# Altium project BMS.PrjPcb (part 2 of 2)

## Sheet NPN_CONNECTOR.SchDoc: BMS - AFE
size A4; DrawnBy: Jarod Krane; SheetNumber: 7; SheetTotal: 8
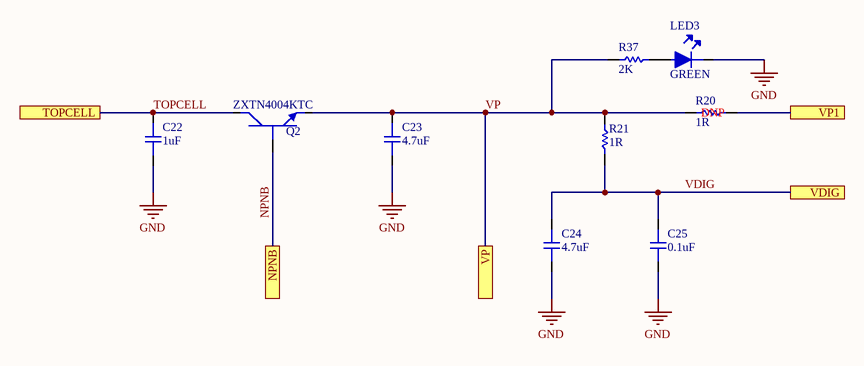
[diagram p6: NPN_CONNECTOR.SchDoc]

### Parts
C22  1uF  [0805 CAP]
C23  4.7uF  [1206 CAP]
C24  4.7uF  [0805 CAP]
C25  0.1uF  [0603 CAP - duplicate]
LED3  GREEN  [LED2]
Q2  ZXTN4004KTC  [NPN TRANSISTOR]
R20  1R  [0603 RES]
R21  1R  [0603 RES]
R37  2K  [0603 RES]

### Ports
NPNB, TOPCELL, VDIG, VP, VP1

### Nets
GND: C22.1 C23.1 C24.1 C25.1 LED3.2
NPNB: Q2.1 ; port NPNB
TOPCELL: C22.2 Q2.2 ; port TOPCELL
VDIG: C24.2 C25.2 R21.1 ; port VDIG
VIO: R20.2 ; port VP1
VP: C23.2 Q2.3 R20.1 R21.2 R37.1 ; port VP
NetLED3_1: LED3.1 R37.2

### Notes on the sheet
- (near R20) DNP

### Library data of the parts
C22 = C2012X7S2A105K125AE: CAP CER 1UF 100V X7S 0805; Manufacturer: TDK; Tolerance: 10%; Supplier 1: Digi-Key; Manufacturer Part Number: C2012X7S2A105K125AE; Stock 1: 20000; Pricing 1: 1=0.5, 10=0.356, 100=0.2347, 500=0.1739, 1000=0.1478 (USD); Mount: Surface Mount; Case/Package: 0805; Case Code (Metric): 2012; Case Code (Imperial): 0805; Min Operating Temperature: -55°C; Max Operating Temperature: 125°C; Capacitance: 1uF; Voltage Rating: 100V; Packaging: Tape and Reel; Termination: SMD/SMT; Package Quantity: 1; Voltage Rating (DC): 100V; Dielectric: X7S; Composition: Ceramic; Features: Soft Termination; Length: 2mm; Height: 1.25mm; Width: 0.05inch; Thickness: 0.049inch; Depth: 1.25mm; Lead Free: Lead Free; ComponentLink1URL: https://product.tdk.com/info/en/catalog/spec/mlccspec_commercial_soft_en.pdf; ComponentLink1Description: https://product.tdk.com/info/en/catalog/spec/mlccspec_commercial_soft_en.pdf; ComponentLink2URL: http://www.mouser.com/ds/2/400/lcc_commercial_soft_en-520032.pdf; ComponentLink2Description: http://www.mouser.com/ds/2/400/lcc_commercial_soft_en-520032.pdf; Supplier Part Number 1: 445-8887-1-ND
C23 = GRM31CR71H475KA12L: CAP CER 4.7UF 50V X7R 1206; Manufacturer: Murata; Material: Ceramic; Tolerance: 10%; Supplier 1: Digi-Key; Manufacturer Part Number: GRM31CR71H475KA12L; Stock 1: 0; Pricing 1: 1=0.98, 10=0.723, 100=0.4961, 500=0.3928, 1000=0.3307 (USD); Mount: Surface Mount; Case/Package: 1206; Case Code (Metric): 3216; Case Code (Imperial): 1206; Min Operating Temperature: -55°C; Max Operating Temperature: 125°C; Capacitance: 4.7uF; Voltage Rating: 50V; Packaging: Tape and Reel; Voltage Rating (DC): 50V; Package Quantity: 2000; Dielectric: X7R; Termination: SMD/SMT; Voltage: 50V; Length: 3.2mm; Height: 1.6mm; Width: 0.063inch; Thickness: 0.071inch; Depth: 1.6mm; Radiation Hardening: No; REACH SVHC: No SVHC; Lead Free: Lead Free; Supplier Part Number 1: 490-6521-1-ND
C24 = CL21B475KOFNFNE: CAP CER 4.7UF 16V X7R 0805; Manufacturer: Samsung; Tolerance: 10%; Supplier 1: Digi-Key; Manufacturer Part Number: CL21B475KOFNFNE; Stock 1: 20000; Pricing 1: 1=0.3, 10=0.208, 100=0.1181, 500=0.0833, 1000=0.0729 (USD); Mount: Surface Mount; Case/Package: 0805; Case Code (Metric): 2012; Case Code (Imperial): 0805; Min Operating Temperature: -55°C; Max Operating Temperature: 125°C; Package Quantity: 1; Packaging: Tape and Reel; Capacitance: 4.7uF; Voltage Rating: 16V; Dielectric: X7R; Length: 0.079inch; Height: 1.25mm; Width: 0.049inch; Thickness: 0.053inch; Depth: 1.25mm; Radiation Hardening: No; Supplier Part Number 1: 1276-2970-1-ND
C25 = 06035C104KAZ2A: CAP CER 0.1UF 50V X7R 0603; Manufacturer: Kyocera AVX; Capacitance: 100nF; Tolerance: 10%; Temperature Coefficient: 30ppm/°C; Supplier 1: Digi-Key; Manufacturer Part Number: 06035C104KAZ2A; Stock 1: 40000; Pricing 1: 1=0.23, 10=0.161, 100=0.0756, 500=0.053, 1000=0.0439 (USD); Mount: PCB,Surface Mount; Case/Package: 0603; Number of Pins: 2; Case Code (Metric): 1608; Case Code (Imperial): 0603; Contact Plating: Matte,Tin; Min Operating Temperature: -55°C; Max Operating Temperature: 125°C; Package Quantity: 1; Voltage Rating: 50V; Packaging: Tape and Reel; Voltage Rating (DC): 50V; Dielectric: X7R; Termination: SMD/SMT; Voltage: 50V; Features: Soft Termination; Length: 1.6mm; Height: 0.94mm; Width: 0.032inch; Thickness: 0.035inch; Depth: 0.81mm; Radiation Hardening: No; REACH SVHC: No SVHC; Lead Free: Lead Free; Supplier Part Number 1: 478-3540-1-ND
LED3 = 150060VS75000: LED GREEN CLEAR 0603 SMD; Manufacturer: Wurth Electronics; Luminous Intensity: 40mcd; Viewing Angle: 140°; Forward Voltage: 2V; Wavelength: 570nm; Lens Style: Clear,Rectangular; Forward Current: 30mA; Test Current: 20mA; Supplier 1: Digi-Key; Manufacturer Part Number: 150060VS75000; Stock 1: 219425; Pricing 1: 1=0.14, 50=0.129, 100=0.11, 500=0.095 (USD); Mount: Surface Mount; Case/Package: 0603; Number of Pins: 2; Colour: Green; Case Code (Metric): 1608; Case Code (Imperial): 0603; Min Operating Temperature: -40°C; Max Operating Temperature: 85°C; Package Quantity: 1; Packaging: Tape and Reel; Dominant Wavelength: 570nm; Length: 1.6mm; Height: 0.7mm; Width: 0.8mm; REACH SVHC: Unknown; ComponentLink1URL: http://www.farnell.com/datasheets/1911347.pdf; ComponentLink1Description: http://www.farnell.com/datasheets/1911347.pdf; ComponentLink2URL: https://katalog.we-online.de/led/datasheet/150060VS75000.pdf; ComponentLink2Description: https://katalog.we-online.de/led/datasheet/150060VS75000.pdf; ComponentLink3URL: https://www.distrelec.biz/Web/Downloads/_t/ds/150060VS75000_eng_tds.pdf?mime=application%2Fpdf; ComponentLink3Description: https://www.distrelec.biz/Web/Downloads/_t/ds/150060VS75000_eng_tds.pdf?mime=application%2Fpdf; ComponentLink4URL: http://www.produktinfo.conrad.com/datenblaetter/750000-774999/759431-da-01-en-CHIPLED_0603_W_KL_H_GRUEN_150060VS7500.pdf; ComponentLink4Description: http://www.produktinfo.conrad.com/datenblaetter/750000-774999/759431-da-01-en-CHIPLED_0603_W_KL_H_GRUEN_150060VS7500.pdf; Supplier Part Number 1: 732-4980-1-ND
Q2 = ZXTN4004KTC: TRANS NPN 150V 1A TO252; Manufacturer: Diodes; Max Power Dissipation: 3.8W; Number of Elements: 1; hFE Min: 100; Emitter Base Voltage (VEBO): 7V; Element Configuration: Single; Supplier 1: Digi-Key; Manufacturer Part Number: ZXTN4004KTC; Stock 1: 27399; Pricing 1: 1=0.49, 10=0.42, 100=0.3134, 500=0.2463, 1000=0.1903 (USD); Mount: Surface Mount; Case/Package: TO-252; Number of Pins: 3; Weight: 0.063493oz; Min Operating Temperature: -55°C; Max Operating Temperature: 150°C; Packaging: Tape and Reel; Package Quantity: 2500; Polarity: NPN; Collector Emitter Voltage (VCEO): 150V; Collector Base Voltage (VCBO): 150V; Continuous Collector Current: 1A; Max Collector Current: 1A; Collector Emitter Breakdown Voltage: 150V; Max Breakdown Voltage: 150V; Power Dissipation: 3.8W; Length: 6.7mm; Height: 6.2mm; Width: 2.39mm; Radiation Hardening: No; Lead Free: Lead Free; REACH SVHC: No SVHC; Supplier Part Number 1: ZXTN4004KTCDICT-ND
R20 R21 = CRL0603-FW-1R00ELF: RES SMD 1 OHM 1% 1/10W 0603; Manufacturer: Bourns; Power Rating: 100mW; Temperature Coefficient: 200ppm/°C; Supplier 1: Digi-Key; Manufacturer Part Number: CRL0603-FW-1R00ELF; Stock 1: 1350; Pricing 1: 1=0.13, 10=0.116, 100=0.0448, 1000=0.0197, 2500=0.017 (USD); Mount: Surface Mount; Case/Package: 0603; Case Code (Metric): 1608; Case Code (Imperial): 0603; Contact Plating: Tin; Min Operating Temperature: -55°C; Max Operating Temperature: 125°C; Resistance: 1R; Packaging: Tape and Reel; Tolerance: 1%; Package Quantity: 5000; Composition: Thick Film; Number of Terminations: 2; Termination: SMD/SMT; Military Standard: Not; Max Power Dissipation: 100mW; Length: 1.6mm; Height: 0.45mm; Width: 0.8mm; Depth: 0.8mm; Radiation Hardening: No; REACH SVHC: No SVHC; Supplier Part Number 1: CRL0603-FW-1R00ELFCT-ND
R37 = CRCW06032K00FKEA: RES SMD 2K OHM 1% 1/10W 0603; Manufacturer: Vishay; Power Rating: 100mW; Resistance: 2kR; Voltage Rating: 75V; Temperature Coefficient: 100ppm/°C; Supplier 1: Digi-Key; Manufacturer Part Number: CRCW06032K00FKEA; Stock 1: 388348; Pricing 1: 1=0.1, 10=0.042, 100=0.017, 1000=0.0076, 2500=0.0066 (USD); Mount: Surface Mount; Case/Package: 0603; Number of Pins: 2; Weight: 7.1E-05oz; Case Code (Imperial): 0603; Case Code (Metric): 1608; Contact Plating: Lead,Tin; Min Operating Temperature: -55°C; Max Operating Temperature: 155°C; Tolerance: 1%; Packaging: Tape and Reel; Composition: Thick Film; Package Quantity: 10; Military Standard: Not; Termination: Solder; Voltage Rating (DC): 75V; Number of Terminations: 2; Max Power Dissipation: 100mW; Features: Automotive AEC-Q200; Length: 1.55mm; Height: 0.45mm; Width: 0.85mm; Depth: 0.85mm; Radiation Hardening: No; REACH SVHC: Unknown; Lead Free: Lead Free; Supplier Part Number 1: 541-2.00KHCT-ND

## Sheet Serial.SchDoc: Serial connection
size A4; DrawnBy: Jarod Krane; SheetNumber: 8; SheetTotal: 8
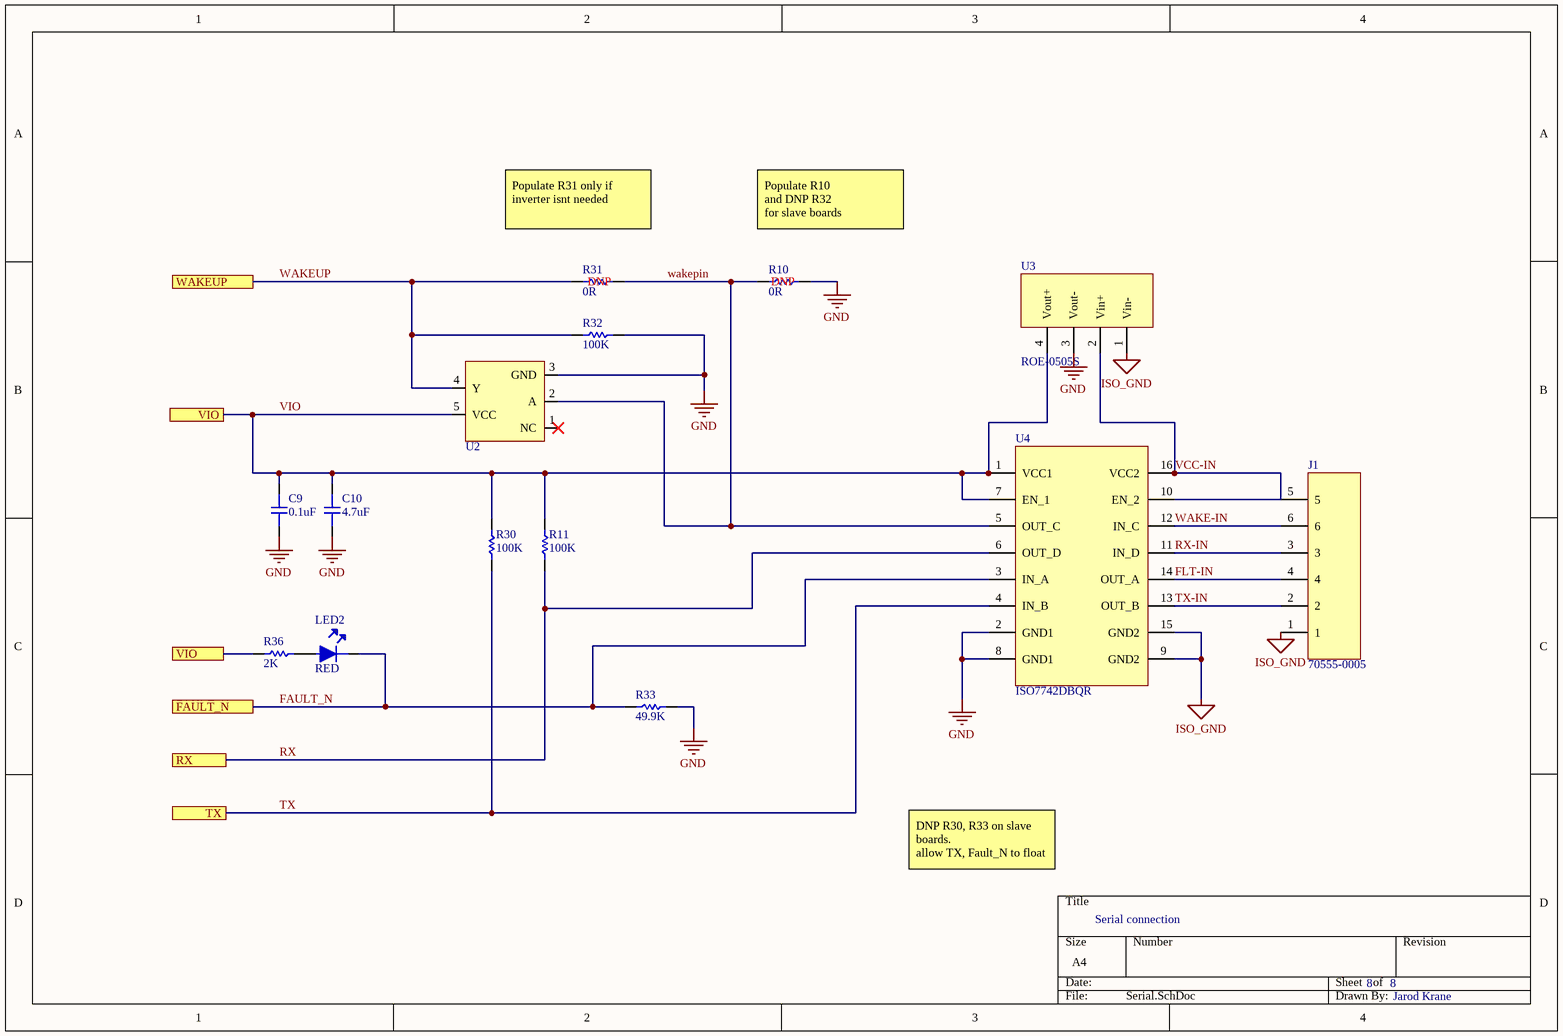
[diagram p7: Serial.SchDoc]

### Parts
C9  0.1uF  [0603 CAP - duplicate]
C10  4.7uF  [0805 CAP]
J1  70555-0005  [SERIAL HDR]
LED2  RED  [LED2]
R10  0R  [1206 RES]
R11  100K  [0603 RES]
R30  100K  [0603 RES]
R31  0R  [1206 RES]
R32  100K  [0603 RES]
R33  49.9K  [0603 RES]
R36  2K  [0603 RES]
U2  NC7SZ04M5X  [Inverter]  (value not drawn)
U3  ROE-0505S  [5V-ISO]
U4  ISO7742DBQR  [Serial-ISO]

### Ports
FAULT_N, RX, TX, VIO, WAKEUP

### Nets
GND: C9.1 C10.1 R10.2 R32.2 R33.2 U2.3(GND) U3.3(Vout-) U4.2(GND1) U4.8(GND1)
ISO_GND: J1.1 U3.1(Vin-) U4.9(GND2) U4.15(GND2)
FAULT_N: LED2.2 R33.1 U4.3(IN_A) ; port FAULT_N
FLT-IN: J1.4 U4.14(OUT_A)
RX: R11.1 U4.6(OUT_D) ; port RX
RX-IN: J1.3 U4.11(IN_D)
TX: R30.1 U4.4(IN_B) ; port TX
TX-IN: J1.2 U4.13(OUT_B)
VCC-IN: J1.5 U3.2(Vin+) U4.10(EN_2) U4.16(VCC2)
VIO: C9.2 C10.2 R11.2 R30.2 R36.2 U2.5(VCC) U3.4(Vout+) U4.1(VCC1) U4.7(EN_1) ; port VIO
WAKE-IN: J1.6 U4.12(IN_C)
wakepin: R10.1 R31.2 U2.2(A) U4.5(OUT_C)
WAKEUP: R31.1 R32.1 U2.4(Y) ; port WAKEUP
NetLED2_1: LED2.1 R36.1

Not connected (* = marked no-connect by the designer): U2 1(NC)*

### Notes on the sheet
- (near R31) Populate R31 only if inverter isnt needed
- (near R10) Populate R10
  and DNP R32
  for slave boards
- (near R31) DNP
- (near R10) DNP
- DNP R30, R33 on slave boards.
  allow TX, Fault_N to float
- 8

### Library data of the parts
C9 = 06035C104KAZ2A: as C25 on sheet NPN_CONNECTOR; Supplier 1: Digi-Key; Manufacturer Part Number: 06035C104KAZ2A; Stock 1: 40000; Pricing 1: 1=0.23, 10=0.161, 100=0.0756, 500=0.053, 1000=0.0439 (USD); Mount: PCB,Surface Mount; Case/Package: 0603; Number of Pins: 2; Case Code (Metric): 1608; Case Code (Imperial): 0603; Contact Plating: Matte,Tin; Min Operating Temperature: -55°C; Max Operating Temperature: 125°C; Package Quantity: 1; Voltage Rating: 50V; Packaging: Tape and Reel; Voltage Rating (DC): 50V; Dielectric: X7R; Termination: SMD/SMT; Voltage: 50V; Features: Soft Termination; Length: 1.6mm; Height: 0.94mm; Width: 0.032inch; Thickness: 0.035inch; Depth: 0.81mm; Radiation Hardening: No; REACH SVHC: No SVHC; Lead Free: Lead Free; Supplier Part Number 1: 478-3540-1-ND
C10 = CL21B475KOFNFNE: as C24 on sheet NPN_CONNECTOR; Supplier 1: Digi-Key; Manufacturer Part Number: CL21B475KOFNFNE; Stock 1: 20000; Pricing 1: 1=0.3, 10=0.208, 100=0.1181, 500=0.0833, 1000=0.0729 (USD); Mount: Surface Mount; Case/Package: 0805; Case Code (Metric): 2012; Case Code (Imperial): 0805; Min Operating Temperature: -55°C; Max Operating Temperature: 125°C; Package Quantity: 1; Packaging: Tape and Reel; Capacitance: 4.7uF; Voltage Rating: 16V; Dielectric: X7R; Length: 0.079inch; Height: 1.25mm; Width: 0.049inch; Thickness: 0.053inch; Depth: 1.25mm; Radiation Hardening: No; Supplier Part Number 1: 1276-2970-1-ND
J1 = 70555-0005: CONN HEADER 6POS .100 R/A TIN; Manufacturer: Molex; Contact Resistance: 30mR; Number of Contacts: 6; Current Rating: 3A; Voltage Rating: 250V; Gender: Female; Insulation Resistance: 1GR; Connector Type: Male Pin; Pitch: 2.54mm; Glow Wire Compliant: Non-compliant; Supplier 1: Digi-Key; Manufacturer Part Number: 70555-0005; Stock 1: 1593; Pricing 1: 1=1.19, 10=1.046, 100=0.902, 500=0.738, 1000=0.656, 5000=0.574, 10000=0.5453 (USD); Mount: Through Hole; Contact Plating: Tin; Contact Material: Brass,Bronze; Housing Color: Black; Housing Material: Polyester; Color: Black; Material: Brass; Min Operating Temperature: -40°C; Max Operating Temperature: 105°C; Number of Rows: 1; Packaging: Rail/Tube; Termination: Solder; Orientation: Right Angle; Package Quantity: 1; Contact Gender: Male; Number of Positions: 6; Voltage Rating (DC): 250V; Number of Circuits: 6; Length: 18.69mm; Depth: 13.59mm; Contact Mating Length: 0.24inch; ELV: Compliant; Flammability Rating: UL94 V-0; ComponentLink1URL: https://www.molex.com/pdm_docs/ps/PS-70400.pdf; ComponentLink1Description: https://www.molex.com/pdm_docs/ps/PS-70400.pdf; ComponentLink2URL: http://www.mouser.com/ds/2/276/0705550005_PCB_HEADERS-172795.pdf; ComponentLink2Description: http://www.mouser.com/ds/2/276/0705550005_PCB_HEADERS-172795.pdf; Supplier Part Number 1: WM4168-ND
LED2 = 150060VS75000: as LED3 on sheet NPN_CONNECTOR; Supplier 1: Digi-Key; Manufacturer Part Number: 150060VS75000; Stock 1: 219425; Pricing 1: 1=0.14, 50=0.129, 100=0.11, 500=0.095 (USD); Mount: Surface Mount; Case/Package: 0603; Number of Pins: 2; Colour: Green; Case Code (Metric): 1608; Case Code (Imperial): 0603; Min Operating Temperature: -40°C; Max Operating Temperature: 85°C; Package Quantity: 1; Packaging: Tape and Reel; Dominant Wavelength: 570nm; Length: 1.6mm; Height: 0.7mm; Width: 0.8mm; REACH SVHC: Unknown; ComponentLink1URL: http://www.farnell.com/datasheets/1911347.pdf; ComponentLink1Description: http://www.farnell.com/datasheets/1911347.pdf; ComponentLink2URL: https://katalog.we-online.de/led/datasheet/150060VS75000.pdf; ComponentLink2Description: https://katalog.we-online.de/led/datasheet/150060VS75000.pdf; ComponentLink3URL: https://www.distrelec.biz/Web/Downloads/_t/ds/150060VS75000_eng_tds.pdf?mime=application%2Fpdf; ComponentLink3Description: https://www.distrelec.biz/Web/Downloads/_t/ds/150060VS75000_eng_tds.pdf?mime=application%2Fpdf; ComponentLink4URL: http://www.produktinfo.conrad.com/datenblaetter/750000-774999/759431-da-01-en-CHIPLED_0603_W_KL_H_GRUEN_150060VS7500.pdf; ComponentLink4Description: http://www.produktinfo.conrad.com/datenblaetter/750000-774999/759431-da-01-en-CHIPLED_0603_W_KL_H_GRUEN_150060VS7500.pdf; Supplier Part Number 1: 732-4980-1-ND
R10 R31 = 0
R11 R30 R32 = ERJ-3EKF1003V: RES SMD 100K OHM 1% 1/10W 0603; Manufacturer: Panasonic; Manufacturer Part Number: ERJ3EKF-1003V; Resistance: 100kR; Power Rating: 100mW; Voltage Rating: 75V; Temperature Coefficient: 100ppm/°C; Supplier 1: Digi-Key; Stock 1: 10349154; Pricing 1: 1=0.1, 10=0.064, 100=0.0261, 1000=0.0117, 2500=0.0102 (USD); Case/Package: 0603; Number of Pins: 2; Case Code (Metric): 1608; Case Code (Imperial): 0603; Contact Plating: Tin; Min Operating Temperature: -55°C; Max Operating Temperature: 155°C; Tolerance: 1%; Packaging: Tape and Reel; Composition: Thick Film; Military Standard: Not; Voltage Rating (DC): 75V; Length: 1.6mm; Depth: 0.8mm; Width: 800um; Radiation Hardening: No; REACH SVHC: No SVHC; Lead Free: Lead Free; Supplier Part Number 1: P100KHCT-ND
R33 = RC0603FR-0749K9L: RES SMD 49.9K OHM 1% 1/10W 0603
R36 = CRCW06032K00FKEA: as R37 on sheet NPN_CONNECTOR; Supplier 1: Digi-Key; Manufacturer Part Number: CRCW06032K00FKEA; Stock 1: 388348; Pricing 1: 1=0.1, 10=0.042, 100=0.017, 1000=0.0076, 2500=0.0066 (USD); Mount: Surface Mount; Case/Package: 0603; Number of Pins: 2; Weight: 7.1E-05oz; Case Code (Imperial): 0603; Case Code (Metric): 1608; Contact Plating: Lead,Tin; Min Operating Temperature: -55°C; Max Operating Temperature: 155°C; Tolerance: 1%; Packaging: Tape and Reel; Composition: Thick Film; Package Quantity: 10; Military Standard: Not; Termination: Solder; Voltage Rating (DC): 75V; Number of Terminations: 2; Max Power Dissipation: 100mW; Features: Automotive AEC-Q200; Length: 1.55mm; Height: 0.45mm; Width: 0.85mm; Depth: 0.85mm; Radiation Hardening: No; REACH SVHC: Unknown; Lead Free: Lead Free; Supplier Part Number 1: 541-2.00KHCT-ND
U2 = NC7SZ04M5X: IC INVERTER 1CH 1-INP SOT23-5; Manufacturer: ON Semiconductor / Fairchild; Max Supply Voltage: 5.5V; Min Supply Voltage: 1.65V; Logic Function: Buffer,Inverter; High Level Output Current: -32mA; Low Level Output Current: 32mA; Propagation Delay: 12ns; Number of Circuits: 1; Quiescent Current: 2uA; Supplier 1: Digi-Key; Manufacturer Part Number: NC7SZ04M5X; Stock 1: 204255; Pricing 1: 1=0.48, 10=0.358, 100=0.203, 500=0.1344, 1000=0.1031 (USD); Mount: Surface Mount; Case/Package: SOT-23; Number of Pins: 5; Weight: 0.03g; Contact Plating: Tin,Matte; Min Operating Temperature: -40°C; Max Operating Temperature: 85°C; Packaging: Tape and Reel; Package Quantity: 1; Number of Inputs: 1; Output Current: 32mA; Number of Elements: 1; Turn-On Delay Time: 12ns; Radiation Hardening: No; REACH SVHC: No SVHC; Lead Free: Lead Free; ComponentLink1URL: http://www.jameco.com/Jameco/Products/ProdDS/1015511.pdf?src-supplier=Jameco; ComponentLink1Description: http://www.jameco.com/Jameco/Products/ProdDS/1015511.pdf?src-supplier=Jameco; ComponentLink2URL: https://www.fairchildsemi.com/datasheets/NC/NC7SZ04.pdf?src-supplier=Digi-Key; ComponentLink2Description: https://www.fairchildsemi.com/datasheets/NC/NC7SZ04.pdf?src-supplier=Digi-Key; ComponentLink3URL: http://www.farnell.com/datasheets/1639856.pdf?src-supplier=Element14; ComponentLink3Description: http://www.farnell.com/datasheets/1639856.pdf?src-supplier=Element14; ComponentLink4URL: http://www.fairchildsemi.com/ds/NC/NC7SZ04.pdf?src-supplier=Avnet+Europe; ComponentLink4Description: http://www.fairchildsemi.com/ds/NC/NC7SZ04.pdf?src-supplier=Avnet+Europe; ComponentLink5URL: https://www.verical.com/server-webapp/html/getDatasheet?partID=120911&src-supplier=Verical; ComponentLink5Description: https://www.verical.com/server-webapp/html/getDatasheet?partID=120911&src-supplier=Verical; ComponentLink6URL: https://www.fairchildsemi.com/datasheets/NC/NC7SZ04.pdf?src-supplier=Avnet; ComponentLink6Description: https://www.fairchildsemi.com/datasheets/NC/NC7SZ04.pdf?src-supplier=Avnet; ComponentLink7URL: http://www.fairchildsemi.com/ds/NC/NC7SZ04.pdf?src-supplier=Future+Electronics; ComponentLink7Description: http://www.fairchildsemi.com/ds/NC/NC7SZ04.pdf?src-supplier=Future+Electronics; Supplier Part Number 1: NC7SZ04M5XCT-ND
U3 = 945-1655-5-ND: DC DC CONVERTER 5V 1W
U4 = 296-49658-1-ND: DG ISO 2.5KV 4CH GEN PRP 16SSOP

## Nets that join several sheets
GND: BMS_rev2 (16 pins), CELL_BALANCE (5 pins), 2/4 (C1_1.1), 2/3 (C1_2.1), 2/2 (C1_3.1), 2/1 (C1_4.1), 2/5 (C1_5.1), 2/6 (C1_6.1), 2/7 (C1_7.1), 2/8 (C1_8.1), 2/12 (C1_9.1), 2/11 (C1_10.1), 2/10 (C1_11.1), 2/9 (C1_12.1), 2/13 (C1_13.1), 2/14 (C1_14.1), 2/15 (C1_15.1), 2/16 (C1_16.1), DAISY_CHAINING (6 pins), THERMO (8 pins), NPN_CONNECTOR (5 pins), Serial (9 pins)
AUX0: BMS_rev2 (U1.66), THERMO (J2.8 R22.1)
AUX1: BMS_rev2 (U1.65), THERMO (J2.7 R23.1)
AUX2: BMS_rev2 (U1.64), THERMO (J2.6 R24.1)
AUX3: BMS_rev2 (U1.63), THERMO (J2.5 R25.1)
AUX4: BMS_rev2 (U1.62), THERMO (J2.4 R26.1)
AUX5: BMS_rev2 (U1.61), THERMO (J2.3 R27.1)
AUX6: BMS_rev2 (U1.60), THERMO (J2.2 R28.1)
AUX7: BMS_rev2 (U1.59), THERMO (J2.1 R29.1)
CELL0: CELL_BALANCE (J4.3), 2/1 (Q1_4.2 R5_4.1)
CELL1: CELL_BALANCE (J4.4), 2/2 (Q1_3.2 R5_3.1), 2/1 (R1_4.2 R2_4.2 R3_4.1)
CELL2: CELL_BALANCE (J4.5), 2/3 (Q1_2.2 R5_2.1), 2/2 (R1_3.2 R2_3.2 R3_3.1)
CELL3: CELL_BALANCE (J4.6), 2/4 (Q1_1.2 R5_1.1), 2/3 (R1_2.2 R2_2.2 R3_2.1)
CELL4: CELL_BALANCE (J4.7), 2/4 (R1_1.2 R2_1.2 R3_1.1), 2/5 (Q1_5.2 R5_5.1)
CELL5: CELL_BALANCE (J4.8), 2/5 (R1_5.2 R2_5.2 R3_5.1), 2/6 (Q1_6.2 R5_6.1)
CELL6: CELL_BALANCE (J4.9), 2/6 (R1_6.2 R2_6.2 R3_6.1), 2/7 (Q1_7.2 R5_7.1)
CELL7: CELL_BALANCE (J4.10), 2/7 (R1_7.2 R2_7.2 R3_7.1), 2/8 (Q1_8.2 R5_8.1)
CELL8: CELL_BALANCE (J4.11), 2/8 (R1_8.2 R2_8.2 R3_8.1), 2/9 (Q1_12.2 R5_12.1)
CELL9: CELL_BALANCE (J4.12), 2/10 (Q1_11.2 R5_11.1), 2/9 (R1_12.2 R2_12.2 R3_12.1)
CELL10: CELL_BALANCE (J4.13), 2/11 (Q1_10.2 R5_10.1), 2/10 (R1_11.2 R2_11.2 R3_11.1)
CELL11: CELL_BALANCE (J4.14), 2/12 (Q1_9.2 R5_9.1), 2/11 (R1_10.2 R2_10.2 R3_10.1)
CELL12: CELL_BALANCE (J4.15), 2/12 (R1_9.2 R2_9.2 R3_9.1), 2/13 (Q1_13.2 R5_13.1)
CELL13: CELL_BALANCE (J4.16), 2/13 (R1_13.2 R2_13.2 R3_13.1), 2/14 (Q1_14.2 R5_14.1)
CELL14: CELL_BALANCE (J4.17), 2/14 (R1_14.2 R2_14.2 R3_14.1), 2/15 (Q1_15.2 R5_15.1)
CELL15: CELL_BALANCE (J4.18), 2/15 (R1_15.2 R2_15.2 R3_15.1), 2/16 (Q1_16.2 R5_16.1)
CELL16: CELL_BALANCE (J4.19), 2/16 (R1_16.2 R2_16.2 R3_16.1)
COMMH+: BMS_rev2 (U1.55), DAISY_CHAINING (D35.2 R99.1)
COMMH-: BMS_rev2 (U1.54), DAISY_CHAINING (D36.2 R100.1)
COMML+: BMS_rev2 (R34.1 U1.52), DAISY_CHAINING (D37.2 R101.1)
COMML-: BMS_rev2 (R35.1 U1.53), DAISY_CHAINING (D38.2 R102.1)
EQ1: BMS_rev2 (U1.28), 2/1 (R4_4.1)
EQ2: BMS_rev2 (U1.26), 2/2 (R4_3.1)
EQ3: BMS_rev2 (U1.24), 2/3 (R4_2.1)
EQ4: BMS_rev2 (U1.22), 2/4 (R4_1.1)
EQ5: BMS_rev2 (U1.20), 2/5 (R4_5.1)
EQ6: BMS_rev2 (U1.18), 2/6 (R4_6.1)
EQ7: BMS_rev2 (U1.16), 2/7 (R4_7.1)
EQ8: BMS_rev2 (U1.14), 2/8 (R4_8.1)
EQ9: BMS_rev2 (U1.12), 2/9 (R4_12.1)
EQ10: BMS_rev2 (U1.10), 2/10 (R4_11.1)
EQ11: BMS_rev2 (U1.8), 2/11 (R4_10.1)
EQ12: BMS_rev2 (U1.6), 2/12 (R4_9.1)
EQ13: BMS_rev2 (U1.4), 2/13 (R4_13.1)
EQ14: BMS_rev2 (U1.2), 2/14 (R4_14.1)
EQ15: BMS_rev2 (U1.80), 2/15 (R4_15.1)
EQ16: BMS_rev2 (U1.78), 2/16 (R4_16.1)
FAULT_N: BMS_rev2 (U1.40), Serial (LED2.2 R33.1 U4.3)
FAULTH+: BMS_rev2 (U1.57), DAISY_CHAINING (D33.2 R97.1)
FAULTH-: BMS_rev2 (U1.56), DAISY_CHAINING (D34.2 R98.1)
FAULTL-: BMS_rev2 (U1.51), DAISY_CHAINING (D39.2 R103.1)
NPNB: BMS_rev2 (U1.71), NPN_CONNECTOR (Q2.1)
RX: BMS_rev2 (U1.39), Serial (R11.1 U4.6)
TOP: BMS_rev2 (U1.76), CELL_BALANCE (C2.2 D2.2 D3.1 R6.1)
TOPCELL: CELL_BALANCE (R8.2), NPN_CONNECTOR (C22.2 Q2.2)
TX: BMS_rev2 (U1.38), Serial (R30.1 U4.4)
VDIG: BMS_rev2 (U1.34), NPN_CONNECTOR (C24.2 C25.2 R21.1)
VIO: BMS_rev2 (U1.41), NPN_CONNECTOR (R20.2), Serial (9 pins)
VP: BMS_rev2 (U1.70), THERMO (8 pins), NPN_CONNECTOR (5 pins)
VSNS0: BMS_rev2 (U1.29), CELL_BALANCE (C3.2 D4.1 D5.2 R9.1), 2/1 (D1_4.1)
VSNS1: BMS_rev2 (U1.27), 2/2 (D1_3.1), 2/1 (C1_4.2 D1_4.2 R1_4.1)
VSNS2: BMS_rev2 (U1.25), 2/3 (D1_2.1), 2/2 (C1_3.2 D1_3.2 R1_3.1)
VSNS3: BMS_rev2 (U1.23), 2/4 (D1_1.1), 2/3 (C1_2.2 D1_2.2 R1_2.1)
VSNS4: BMS_rev2 (U1.21), 2/4 (C1_1.2 D1_1.2 R1_1.1), 2/5 (D1_5.1)
VSNS5: BMS_rev2 (U1.19), 2/5 (C1_5.2 D1_5.2 R1_5.1), 2/6 (D1_6.1)
VSNS6: BMS_rev2 (U1.17), 2/6 (C1_6.2 D1_6.2 R1_6.1), 2/7 (D1_7.1)
VSNS7: BMS_rev2 (U1.15), 2/7 (C1_7.2 D1_7.2 R1_7.1), 2/8 (D1_8.1)
VSNS8: BMS_rev2 (U1.13), 2/8 (C1_8.2 D1_8.2 R1_8.1), 2/9 (D1_12.1)
VSNS9: BMS_rev2 (U1.11), 2/10 (D1_11.1), 2/9 (C1_12.2 D1_12.2 R1_12.1)
VSNS10: BMS_rev2 (U1.9), 2/11 (D1_10.1), 2/10 (C1_11.2 D1_11.2 R1_11.1)
VSNS11: BMS_rev2 (U1.7), 2/12 (D1_9.1), 2/11 (C1_10.2 D1_10.2 R1_10.1)
VSNS12: BMS_rev2 (U1.5), 2/12 (C1_9.2 D1_9.2 R1_9.1), 2/13 (D1_13.1)
VSNS13: BMS_rev2 (U1.3), 2/13 (C1_13.2 D1_13.2 R1_13.1), 2/14 (D1_14.1)
VSNS14: BMS_rev2 (U1.1), 2/14 (C1_14.2 D1_14.2 R1_14.1), 2/15 (D1_15.1)
VSNS15: BMS_rev2 (U1.79), 2/15 (C1_15.2 D1_15.2 R1_15.1), 2/16 (D1_16.1)
VSNS16: BMS_rev2 (U1.77), CELL_BALANCE (D2.1 D3.2), 2/16 (C1_16.2 D1_16.2 R1_16.1)
WAKEUP: BMS_rev2 (U1.49), Serial (R31.1 R32.1 U2.4)